# EasyEDA Pro project ADC前置_加减法_AD835_单运放放大.eprj

# Schematic Schematic1
Board Name: Board1; Create Date: 2025-03-10; Page Name: P1; Project Name: ADC前置_加减法_AD835_单运放放大; Schematic Name: Schematic1; Update Date: 2025-06-29; Company: 嘉立创EDA; Page Size: A4; Version: V1.0
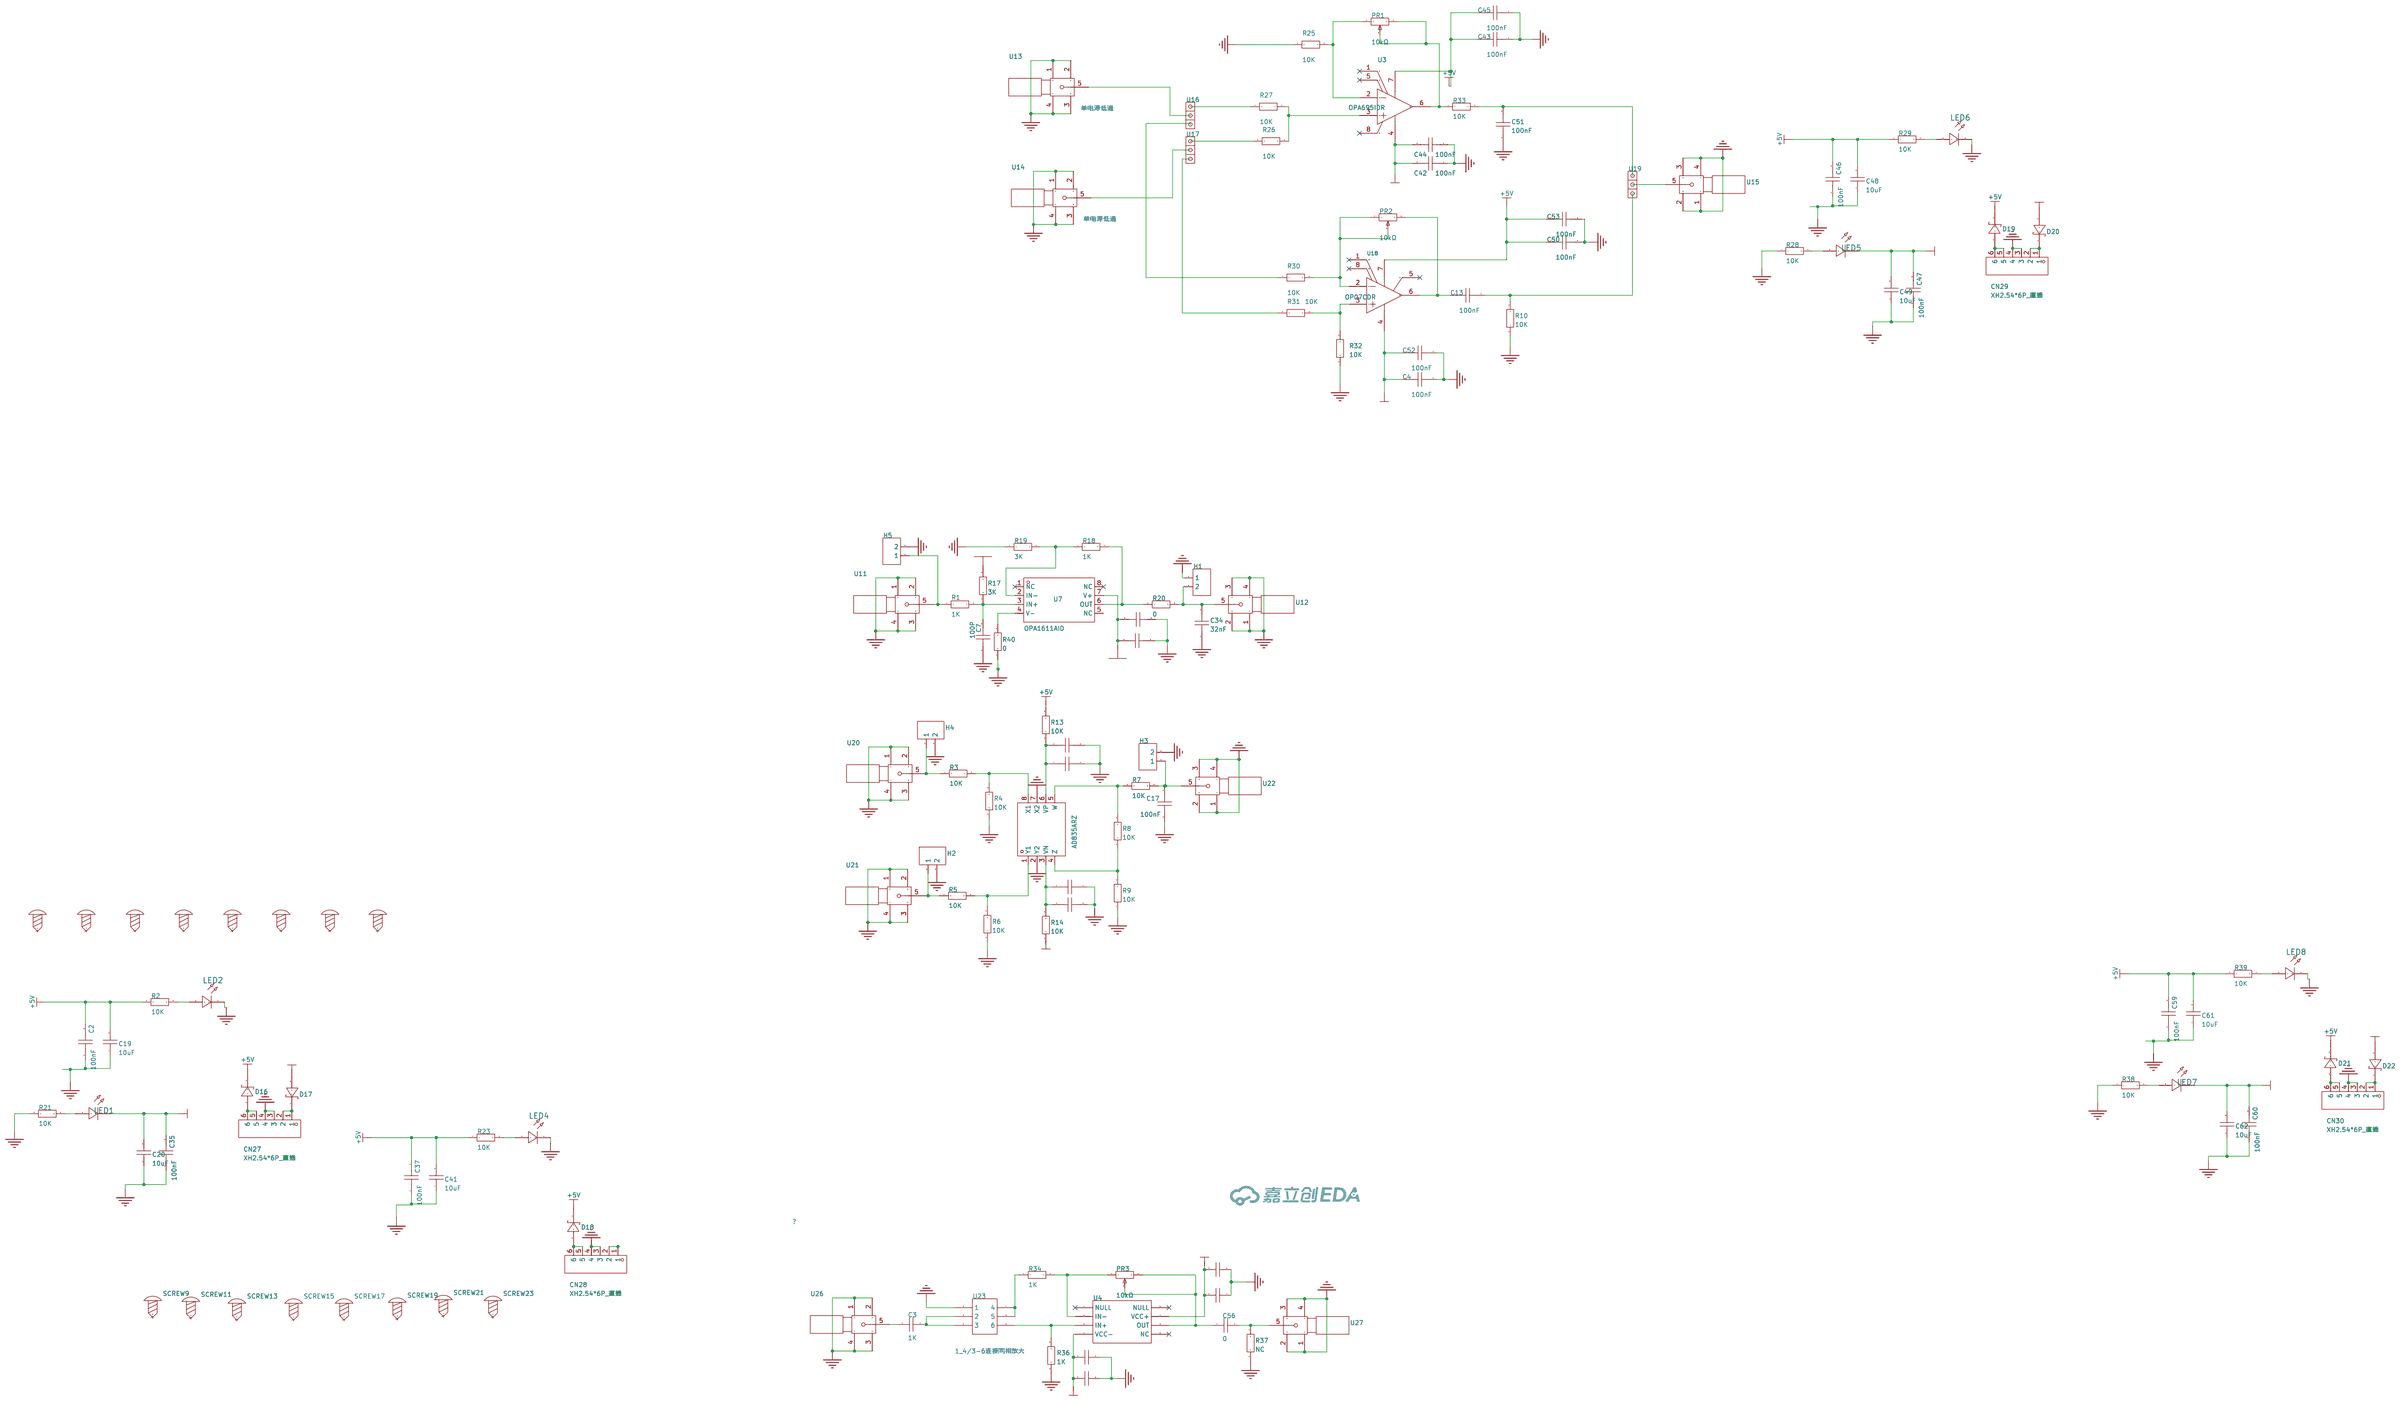
[diagram p0: schematic sheet]

## Parts
C2  100nF  [R0805]
C3  1K  [R0805]
C4  100nF  [R0805]
C5  100nF  [R0805]
C6  100nF  [R0805]
C7  100P  [R0805]
C8  100nF  [R0805]
C9  100nF  [R0805]
C10  100nF  [R0805]
C13  100nF  [R0805]
C17  100nF  [R0805]
C19  10uF  [C1210]
C20  10uF  [C1210]
C34  32nF  [R0805]
C35  100nF  [R0805]
C36  100nF  [R0805]
C37  100nF  [R0805]
C41  10uF  [C1210]
C42  100nF  [R0805]
C43  100nF  [R0805]
C44  100nF  [R0805]
C45  100nF  [R0805]
C46  100nF  [R0805]
C47  100nF  [R0805]
C48  10uF  [C1210]
C49  10uF  [C1210]
C50  100nF  [R0805]
C51  100nF  [R0805]
C52  100nF  [R0805]
C53  100nF  [R0805]
C54  104  [R0805]
C55  104  [R0805]
C56  0  [R0805]
C57  104  [R0805]
C58  104  [R0805]
C59  100nF  [R0805]
C60  100nF  [R0805]
C61  10uF  [C1210]
C62  10uF  [C1210]
CN27  XH2.54*6P_直插  [CONN-TH_XH2.54-6P]
CN28  XH2.54*6P_直插  [CONN-TH_XH2.54-6P]
CN29  XH2.54*6P_直插  [CONN-TH_XH2.54-6P]
CN30  XH2.54*6P_直插  [CONN-TH_XH2.54-6P]
D16  SD103AWS  [SOD-323_L1.8-W1.3-LS2.5-RD]
D17  SD103AWS  [SOD-323_L1.8-W1.3-LS2.5-RD]
D18  SD103AWS  [SOD-323_L1.8-W1.3-LS2.5-RD]
D19  SD103AWS  [SOD-323_L1.8-W1.3-LS2.5-RD]
D20  SD103AWS  [SOD-323_L1.8-W1.3-LS2.5-RD]
D21  SD103AWS  [SOD-323_L1.8-W1.3-LS2.5-RD]
D22  SD103AWS  [SOD-323_L1.8-W1.3-LS2.5-RD]
H1  -  [HDR-TH_2P-P2.54-V-F]
H2  -  [HDR-TH_2P-P2.54-V-F]
H3  -  [HDR-TH_2P-P2.54-V-F]
H4  -  [HDR-TH_2P-P2.54-V-F]
H5  -  [HDR-TH_2P-P2.54-V-F]
LED1  -  [LED_0805]
LED2  -  [LED_0805]
LED4  -  [LED_0805]
LED5  -  [LED_0805]
LED6  -  [LED_0805]
LED7  -  [LED_0805]
LED8  -  [LED_0805]
PR1  10kΩ  [R_3296]
PR2  10kΩ  [R_3296]
PR3  10kΩ  [R_3296]
R1  1K  [R0805]
R2  10K  [R0805]
R3  10K  [R0805]
R4  10K  [R0805]
R5  10K  [R0805]
R6  10K  [R0805]
R7  10K  [R0805]
R8  10K  [R0805]
R9  10K  [R0805]
R10  10K  [R0805]
R13  10K  [R0805]
R14  10K  [R0805]
R17  3K  [R0805]
R18  1K  [R0805]
R19  3K  [R0805]
R20  0  [R0805]
R21  10K  [R0805]
R23  10K  [R0805]
R25  10K  [R0805]
R26  10K  [R0805]
R27  10K  [R0805]
R28  10K  [R0805]
R29  10K  [R0805]
R30  10K  [R0805]
R31  10K  [R0805]
R32  10K  [R0805]
R33  10K  [R0805]
R34  1K  [R0805]
R36  1K  [R0805]
R37  NC  [R0805]
R38  10K  [R0805]
R39  10K  [R0805]
R40  0  [R0805]
SCREW1  -  [M3螺丝]
SCREW2  -  [M3螺丝]
SCREW3  -  [M3螺丝]
SCREW4  -  [M3螺丝]
SCREW5  -  [M3螺丝]
SCREW6  -  [M3螺丝]
SCREW7  -  [M3螺丝]
SCREW8  -  [M3螺丝]
SCREW9  -  [M3螺丝]
SCREW11  -  [M3螺丝]
SCREW13  -  [M3螺丝]
SCREW15  -  [M3螺丝]
SCREW17  -  [M3螺丝]
SCREW19  -  [M3螺丝]
SCREW21  -  [M3螺丝]
SCREW23  -  [M3螺丝]
U1  AD835ARZ  [SOIC-8_L4.9-W3.9-P1.27-LS6.0-TL]
U3  OPA695IDR  [SOIC-8_L5.0-W4.0-P1.27-LS6.1-BL]
U4  -  [THS4001CD]
U7  OPA1611AID  [SOIC-8_L4.9-W3.9-P1.27-LS6.0-BL]
U11  -  [SMA]
U12  -  [SMA]
U13  -  [SMA]
U14  -  [SMA]
U15  -  [SMA]
U16  -  [1*3跳线]
U17  -  [1*3跳线]
U18  OP07CDR  [SOIC-8_L4.9-W3.9-P1.27-LS6.0-BL]
U19  -  [1*3跳线]
U20  -  [SMA]
U21  -  [SMA]
U22  -  [SMA]
U23  -  [3*3连跳线帽]
U26  -  [SMA]
U27  -  [SMA]

## Library data of the parts
C2 C4-C10 C13 C17 C34-C37 C42-C47 C50-C53 C59 C60 = CAP_0805: Supplier Footprint: 0805
C3 C54-C58 = CL21C101JBANNNC: 容值:100pF;精度:±5%;额定电压:50V;材质(温度系数):C0G;; LCSC Part Name: 100pF ±5% 50V; Supplier Part: C1790; Manufacturer: SAMSUNG(三星); Supplier Footprint: 0805; JLCPCB Part Class: 基础库; Datasheet: https://atta.szlcsc.com/upload/public/pdf/source/20160218/1457707763339.pdf; Supplier: LCSC; Tolerance: ±5%; Voltage Rated: 50V; Temperature Coefficient: C0G
C19 C20 C41 C48 C49 C61 C62 = CL32B106KAJNNNE: 容值:10uF;精度:±10%;额定电压:25V;材质(温度系数):X7R;; LCSC Part Name: 10uF ±10% 25V; Supplier Part: C39232; Manufacturer: SAMSUNG(三星); Supplier Footprint: 1210; JLCPCB Part Class: 扩展库; Datasheet: https://atta.szlcsc.com/upload/public/pdf/source/20160218/1457707763339.pdf; Supplier: LCSC; Tolerance: ±10%; Voltage Rated: 25V; Temperature Coefficient: X7R
CN27-CN30 = XH2.54*6P_直插: Supplier Part: C9900008614; Supplier Footprint: XH2.54_6P; JLCPCB Part Class: 扩展库; Supplier: LCSC
D16-D22 = SD103AWS_C181207: 正向压降(Vf):600mV@200mA;直流反向耐压(Vr):40V;整流电流:350mA;; LCSC Part Name: 电压:40V 电流:350mA 丝印S4; Supplier Part: C181207; Manufacturer: Hottech(合科泰); Supplier Footprint: SOD-323; JLCPCB Part Class: 扩展库; Datasheet: https://atta.szlcsc.com/upload/public/pdf/source/20240513/4691873FBB9173EFBCF4C6FD4BBA1025.pdf; Supplier: LCSC; Forward Voltage (Vf@If): 600mV@200mA; Reverse Voltage (Vr): 40V; Rectified Current: 350mA
H1-H5 = HDR-F_2.54_1x2P: Supplier Part: C49661; Supplier Footprint: 插件
LED1 LED2 LED4-LED8 = LED_0805-R: Supplier Footprint: 0805
PR1-PR3 = R_3296: Supplier Footprint: 直插
R1-R10 R13 R14 R17-R21 R23 R25-R33 R38-R40 = Res_0805: Supplier Footprint: 0805
R34 R36 R37 = 0805W8F510JT5E: 电阻类型:厚膜电阻;阻值:51Ω;精度:±1%;功率:125mW;最大工作电压:150V;温度系数:±100ppm/℃;; LCSC Part Name: 51Ω ±1% 125mW 厚膜电阻; Supplier Part: C17738; Manufacturer: UNI-ROYAL(厚声); Supplier Footprint: 0805; JLCPCB Part Class: 基础库; Datasheet: https://atta.szlcsc.com/upload/public/pdf/source/20200306/C422600_1E6D84923E4A46A82E41ADD87F860B5C.pdf; Supplier: LCSC; Type: 厚膜电阻; Tolerance: ±1%; Power(Watts): 125mW; Overload Voltage (Max): 150V; Temperature Coefficient: ±100ppm/℃; Operating Temperature Range: -55℃~+155℃
SCREW1-SCREW9 SCREW11 SCREW13 SCREW15 SCREW17 SCREW19 SCREW21 SCREW23 = M3螺丝: Supplier Footprint: 插件
U1 = AD835ARZ: 象限:四象限;压摆率(SR):1000V/us;带宽:250MHz;; LCSC Part Name: 250 MHz 四象限电压输出乘法器; Supplier Part: C26332; Manufacturer: ADI(亚德诺); Supplier Footprint: SOIC-8; JLCPCB Part Class: 扩展库; Datasheet: https://atta.szlcsc.com/upload/public/pdf/source/20140314/1457707016009.pdf; Supplier: LCSC; Quadrant: 四象限; Slew Rate (SR): 1000V/us; Bandwidth: 250MHz; Supply Voltage: 4.5V~5.5V; Supply Current: 25mA; Operating Temperature: -40℃~+85℃
U3 = OPA695IDR: 放大器数:单路;增益带宽积(GBP):-;输入偏置电流(Ib):20uA;压摆率(SR):4300V/us;带宽(-3db):1.7GHz;; Supplier Part: C1848175; Manufacturer: TI(德州仪器); Supplier Footprint: SOIC-8; JLCPCB Part Class: 扩展库; Datasheet: https://www.ti.com/cn/lit/gpn/opa695; Supplier: LCSC; Number of Circuits: 单路; Current - Input Bias(Ib): 20uA; Slew Rate(SR): 4300V/us; Output Current: 120mA; -3db Bandwidth: 1.7GHz; Operating Temperature: -40℃~+85℃
U4 = THS4001CD
U7 = OPA1611AID: 扬声器通道数:单声道;; Supplier Part: C181405; Manufacturer: TI(德州仪器); Supplier Footprint: SOIC-8; JLCPCB Part Class: 扩展库; Datasheet: https://www.ti.com/cn/lit/gpn/opa1611; Supplier: LCSC; Speaker Channels: 单声道; Operating Temperature: -40℃~+85℃
U11-U15 U20-U22 U26 U27 = SMA
U16 U17 U19 = 1*3跳线
U18 = OP07CDR: 放大器组数:1;增益带宽积(GBP):600kHz;压摆率(SR):0.3V/us;; Supplier Part: C7433; Manufacturer: TI(德州仪器); Supplier Footprint: SOP-8; JLCPCB Part Class: 基础库; Datasheet: http://www.ti.com/cn/lit/gpn/op07c; Supplier: LCSC; Number of Circuits: 1; Gain Bandwidth Product(GBP): 600kHz; Slew Rate(SR): 0.3V/us; Operating Temperature: 0℃~+70℃
U23 = 3*3连跳线帽

## Nets
+5V: C2.2 C5.1 C6.1 C19.2 C37.2 C41.2 C43.2 C45.2 C46.2 C48.2 C50.1 C53.1 C55.2 C58.2 C59.2 C61.2 D16.1(C) D18.1(C) D19.1(C) D21.1(C) R2.1 R13.2 R17.2 R23.1 R29.1 R39.1 U3.7(+VS) U4.7(VCC+) U7.7(V+) U18.7(VCC+)
-5V: C4.1 C20.2 C35.2 C42.2 C44.2 C47.2 C49.2 C52.1 C54.2 C57.2 C60.2 C62.2 D17.2(A) D20.2(A) D22.2(A) LED1.1(C) LED5.1(C) LED7.1(C) R14.1 U3.4(-VS) U4.4(VCC-) U18.4(VCC-)
GND: C2.1 C4.2 C5.2 C6.2 C7.1 C8.2 C9.2 C10.2 C17.1 C19.1 C20.1 C34.1 C35.1 C36.2 C37.1 C41.1 C42.1 C43.1 C44.1 C45.1 C46.1 C47.1 C48.1 C49.1 C50.2 C51.1 C52.2 C53.2 C54.1 C55.1 C57.1 C58.1 C59.1 C60.1 C61.1 C62.1 CN27.3 CN27.4 CN28.3 CN28.4 CN29.3 CN29.4 CN30.3 CN30.4 H1.1 H2.2 H3.2 H4.2 H5.2 LED2.1(C) LED4.1(C) LED6.1(C) LED8.1(C) R4.1 R6.1 R9.1 R10.2 R19.1 R21.1 R25.1 R28.1 R32.1 R36.1 R37.2 R38.1 R40.1 U1.2(Y2) U1.7(X2) U11.1 U11.2 U11.3 U11.4 U12.1 U12.2 U12.3 U12.4 U13.1 U13.2 U13.3 U13.4 U14.1 U14.2 U14.3 U14.4 U15.1 U15.2 U15.3 U15.4 U20.1 U20.2 U20.3 U20.4 U21.1 U21.2 U21.3 U21.4 U22.1 U22.2 U22.3 U22.4 U23.1 U26.1 U26.2 U26.3 U26.4 U27.1 U27.2 U27.3 U27.4
$1N615: R40.2 U7.4(V-)
$1N616: C7.2 R1.2 R17.1 U7.3(IN+)
$1N625: H5.1 R1.1 U11.5
$1N831: R18.1 R19.2 U7.2(IN-)
$1N868: C34.2 H1.2 R20.2 U12.5
$1N887: R18.2 R20.1 U7.6(OUT)
$1N2215: LED1.2(A) R21.2
$1N2216: LED2.2(A) R2.2
$1N2222: H2.1 R5.1 U21.5
$1N2223: R3.2 R4.2 U1.8(X1)
$1N2224: R5.2 R6.2 U1.1(Y1)
$1N2225: R7.1 R8.2 U1.5(W)
$1N2226: C8.1 C36.1 R13.1 U1.6(VP)
$1N2227: C9.1 C10.1 R14.2 U1.3(VN)
$1N2238: H4.1 R3.1 U20.5
$1N2244: R8.1 R9.2 U1.4(Z)
$1N2423: CN27.5 CN27.6 D16.2(A)
$1N2424: CN27.1 CN27.2 D17.1(C)
$1N2910: CN28.1 CN28.2
$1N2912: CN28.5 CN28.6 D18.2(A)
$1N2922: LED4.2(A) R23.2
$1N5837: R26.2 R27.2 U3.3(+IN)
$1N6828: LED6.2(A) R29.2
$1N6831: CN29.1 CN29.2 D20.1(C)
$1N6833: LED5.2(A) R28.2
$1N6836: CN29.5 CN29.6 D19.2(A)
$1N6851: U13.5 U16.2
$1N6855: R26.1 U17.1
$1N6938: R27.1 U16.1
$1N6961: U14.5 U17.2
$1N7310: PR2.1 PR2.2 R30.2 U18.2(IN-)
$1N7312: R31.2 R32.2 U18.3(IN+)
$1N7316: C13.2 R10.1 U19.3
$1N7320: R30.1 U16.3
$1N7321: R31.1 U17.3
$1N7401: C51.2 R33.2 U19.1
$1N7406: PR1.2 PR1.3 R33.1 U3.6(Output)
$1N7721: U15.5 U19.2
$1N7904: C17.2 H3.1 R7.2 U22.5
$1N8307: PR1.1 R25.2 U3.2(-IN)
$1N10205: C13.1 PR2.3 U18.6(OUT)
$1N10928: C3.2 U23.2 U23.3
$1N10939: C56.2 R37.1 U27.5
$1N10941: C3.1 U26.5
$1N10942: R34.1 U23.4 U23.5
$1N10943: R36.2 U4.3(IN+) U23.6
$1N11055: C56.1 PR3.2 PR3.3 U4.6(OUT)
$1N11124: PR3.1 R34.2 U4.2(IN-)
$1N11684: LED7.2(A) R38.2
$1N11686: CN30.5 CN30.6 D21.2(A)
$1N11690: LED8.2(A) R39.2
$1N11693: CN30.1 CN30.2 D22.1(C)

Not connected (* = marked no-connect by the designer): SCREW1 1; SCREW2 1; SCREW3 1; SCREW4 1; SCREW5 1; SCREW6 1; SCREW7 1; SCREW8 1; SCREW9 1; SCREW11 1; SCREW13 1; SCREW15 1; SCREW17 1; SCREW19 1; SCREW21 1; SCREW23 1; U3 1(NC)* 5(NC)* 8(DIS#)*; U4 1(NULL)* 5(NC)* 8(NULL)*; U7 1(NC)* 5(NC) 8(NC)*; U18 1(OFFSET N1)* 5(NC)* 8(OFFSET N2)*

## Notes on the sheet
- 单电源低通
- 单电源低通
- 1_4/3-6连接同相放大

# Board PCB1
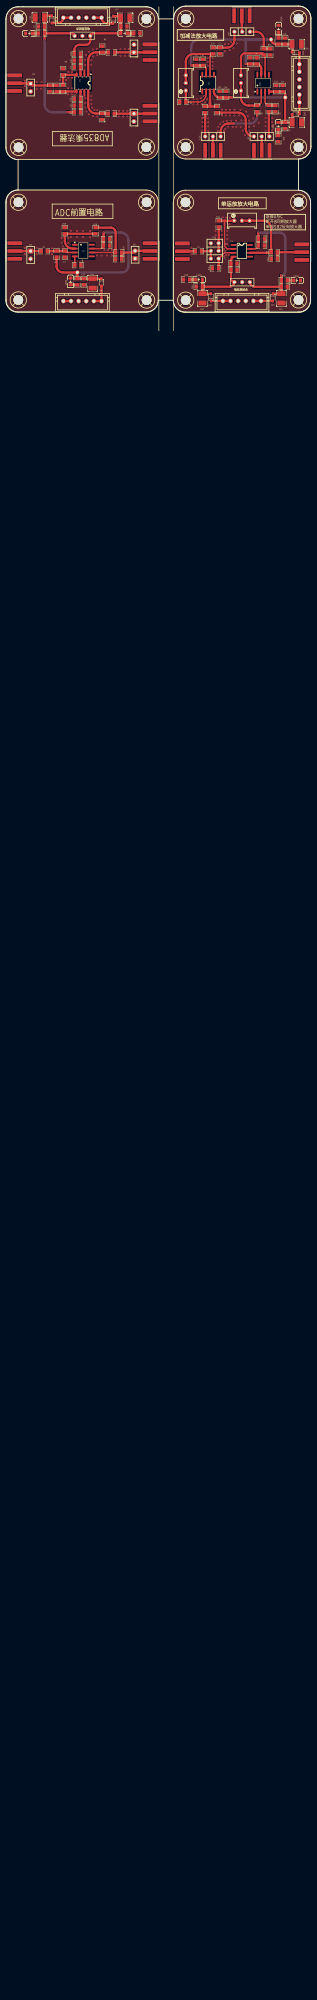
[diagram p1: board, top side]
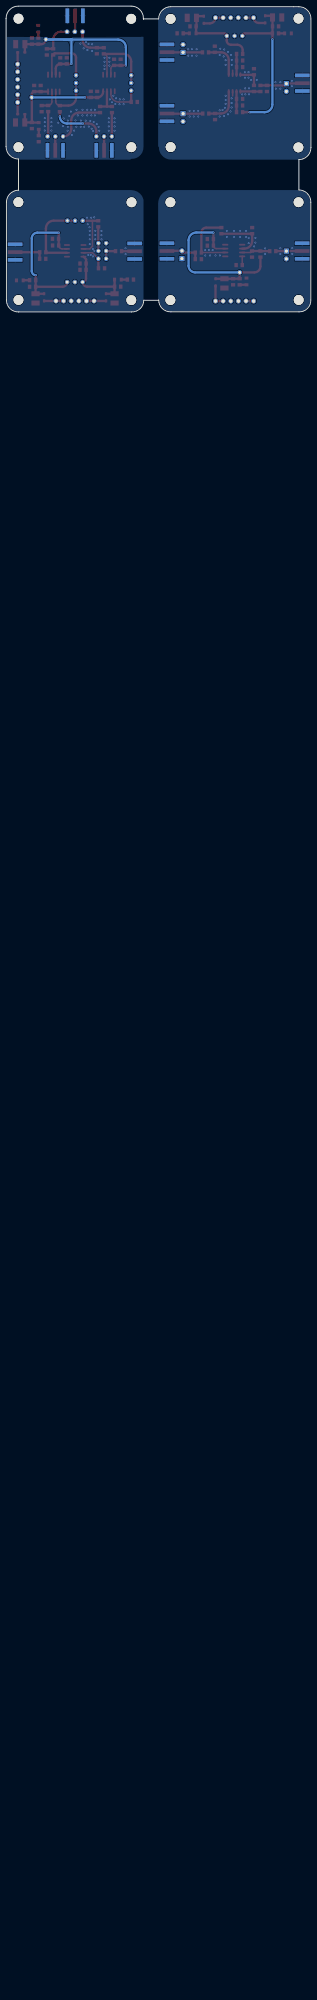
[diagram p2: board, bottom side, seen from below]

Outline 99.9 x 100.01 mm; copper layers: Top Layer, Bottom Layer. Coordinates in mm from the lower left corner of the outline.
Outline path: 54.9,95.81 49.9,95.81 arc(48.73,98.64) 45.9,99.81 3.9,99.81 arc(1.11,98.63) 0,95.81 0,53.81 arc(1.11,51) 3.9,49.81 arc(3.92,49.8) 3.93,49.78 3.93,39.88 arc(1.13,38.68) 0.04,35.84 0.04,3.87 arc(1.13,1.12) 3.89,0.02 45.89,0.02 arc(48.7,1.1) 49.89,3.87 arc(49.91,3.82) 49.96,3.8 54.79,3.8 arc(55.99,1.05) 58.79,0 95.79,0 arc(98.6,1.05) 99.79,3.8 99.79,35.8 arc(98.62,38.63) 95.79,39.8 arc(95.83,39.82) 95.85,39.86 95.85,50.01 arc(98.71,51.2) 99.9,54.06 99.9,96.01 arc(98.73,98.84) 95.9,100.01 58.9,100.01 arc(56.07,98.84) 54.9,96.01 54.9,95.81 ; 54.9,95.81 54.9,95.81 ; 54.9,95.81 arc(54.9,95.81) 54.9,95.81 ; 54.9,95.81 54.9,95.81
Stack: Top Layer 0.035mm / Dielectric1 1.51mm FR4 er 4.5 / Bottom Layer 0.035mm

## Design rules (mm)
template: 自定义配置
spacing copperThickness1oz (default): track to track 0.152, other pairs 0.152 to 0.3
spacing copperThickness2oz: track to track 0.203, other pairs 0.152 to 0.3
track width copperThickness1oz (default): min 0.127, default 0.254, max 2.54
track width copperThickness2oz: min 0.203, default 0.254, max 2.54
differential pair differentialPair (default): width min 0.127, default 0.254, max 2.54; gap min 0.152, default 0.152
via viaSize (default): diameter min 0.5, default 0.61, max 10; hole min 0.3, default 0.305, max 6.299

## Placement (name value [footprint] x y rotation side)
C2  100nF  [R0805#2]  11.69 93.38 0 top
C3  1K  [R0805#2]  63.15 19.86 0 top
C4  100nF  [R0805#2]  90.7 73.16 90 top
C5  100nF  [R0805#2]  33.05 23.83 0 top
C6  100nF  [R0805#2]  33.05 21.67 0 top
C7  100P  [R0805#2]  19.3 19.02 90 top
C8  100nF  [R0805#2]  23.27 67.5 180 top
C9  100nF  [R0805#2]  23.25 80.06 180 top
C10  100nF  [R0805#2]  23.25 82.22 180 top
C13  100nF  [R0805#2]  84.45 85.16 90 top
C17  100nF  [R0805#2]  14.43 73.18 90 top
C19  10uF  [C1210]  11.06 96.3 0 top
C20  10uF  [C1210]  39.02 96.17 180 top
C34  32nF  [R0805#2]  37 17.24 0 top
C35  100nF  [R0805#2]  38.52 93.38 180 top
C36  100nF  [R0805#2]  23.27 69.67 180 top
C37  100nF  [R0805#2]  25.5 9.96 90 top
C41  10uF  [C1210]  28.35 9.31 90 top
C42  100nF  [R0805#2]  70.06 71.01 270 top
C43  100nF  [R0805#2]  62.36 81.51 270 top
C44  100nF  [R0805#2]  72.13 71.03 270 top
C45  100nF  [R0805#2]  64.51 81.5 270 top
C46  100nF  [R0805#2]  91.45 88.46 270 top
C47  100nF  [R0805#2]  91.46 61.07 90 top
C48  10uF  [C1210]  95.25 87.56 180 top
C49  10uF  [C1210]  95.3 61.96 180 top
C50  100nF  [R0805#2]  82.16 82.21 90 top
C51  100nF  [R0805#2]  70.16 85.53 90 top
C52  100nF  [R0805#2]  88.57 73.16 90 top
C53  100nF  [R0805#2]  80 82.21 90 top
C54  104  [R0805#2]  74.57 15.82 180 top
C55  104  [R0805#2]  83.6 23.91 180 top
C56  0  [R0805#2]  87.99 19.51 0 top
C57  104  [R0805#2]  74.58 13.76 180 top
C58  104  [R0805#2]  83.55 21.72 180 top
C59  100nF  [R0805#2]  91.1 8.21 180 top
C60  100nF  [R0805#2]  63.45 8.26 0 top
C61  10uF  [C1210]  90.25 4.41 90 top
C62  10uF  [C1210]  64.35 4.41 90 top
CN27  XH2.54*6P_直插  [CONN-TH_XH2.54-6P]  25.04 96.22 180 top
CN28  XH2.54*6P_直插  [CONN-TH_XH2.54-6P]  25.02 3.54 0 top
CN29  XH2.54*6P_直插  [CONN-TH_XH2.54-6P]  96.13 74.78 90 top
CN30  XH2.54*6P_直插  [CONN-TH_XH2.54-6P]  77.32 3.58 0 top
D16  SD103AWS  [SOD-323_L1.8-W1.3-LS2.5-RD]  14.98 95.68 270 top
D17  SD103AWS  [SOD-323_L1.8-W1.3-LS2.5-RD]  35.1 95.55 90 top
D18  SD103AWS  [SOD-323_L1.8-W1.3-LS2.5-RD]  31.25 9.66 270 top
D19  SD103AWS  [SOD-323_L1.8-W1.3-LS2.5-RD]  94.93 84.88 0 top
D20  SD103AWS  [SOD-323_L1.8-W1.3-LS2.5-RD]  94.93 64.68 180 top
D21  SD103AWS  [SOD-323_L1.8-W1.3-LS2.5-RD]  87.45 4.76 270 top
D22  SD103AWS  [SOD-323_L1.8-W1.3-LS2.5-RD]  67.15 4.76 90 top
H1  -  [HDR-TH_2P-P2.54-V-F]  42.28 18.7 90 top
H2  -  [HDR-TH_2P-P2.54-V-F]  41.91 86.15 90 top
H3  -  [HDR-TH_2P-P2.54-V-F]  8.05 73.38 270 top
H4  -  [HDR-TH_2P-P2.54-V-F]  41.91 63.55 270 top
H5  -  [HDR-TH_2P-P2.54-V-F]  8.05 18.61 270 top
LED1  -  [LED_0805]  38.78 91.11 0 top
LED2  -  [LED_0805]  7.56 91.09 0 top
LED4  -  [LED_0805]  21.1 9.91 270 top
LED5  -  [LED_0805]  89.19 60.76 270 top
LED6  -  [LED_0805]  89.33 92.58 270 top
LED7  -  [LED_0805]  63.2 10.56 180 top
LED8  -  [LED_0805]  95.35 10.31 180 top
NOREF  -  [Pad_e586]  86.85 89.11 0 top
NOREF#2  -  [Pad_e249]  23.35 12.91 0 top
NOREF#3  -  [Pad_e705]  91.5 70.14 0 top
NOREF#4  -  [Pad_e1287]  79.9 9.75 180 top
NOREF#5  -  [Pad_e608]  25.02 90.26 0 top
NOREF#6  -  [Pad_e1288]  77.36 9.75 180 top
NOREF#7  -  [Pad_e610]  27.56 90.26 0 top
NOREF#8  -  [Pad_e609]  22.48 90.26 0 top
NOREF#9  -  [Pad_e1289]  74.82 9.75 180 top
PR1  10kΩ  [R_3296]  58.78 74.88 90 top
PR2  10kΩ  [R_3296]  76.85 74.86 90 top
PR3  10kΩ  [R_3296]  77.3 29.96 0 top
R1  1K  [R0805]  12.5 19.86 0 top
R2  10K  [R0805]  11.61 91.09 180 top
R3  10K  [R0805]  34.45 64.87 180 top
R4  10K  [R0805]  31.42 63.89 90 top
R5  10K  [R0805]  34.54 84.88 180 top
R6  10K  [R0805]  31.49 85.9 270 top
R7  10K  [R0805]  16.55 73.07 90 top
R8  10K  [R0805]  18.67 73.07 270 top
R9  10K  [R0805]  18.67 78.53 270 top
R10  10K  [R0805]  86.56 85.03 270 top
R13  10K  [R0805]  23.38 65.33 180 top
R14  10K  [R0805]  23.37 84.38 0 top
R17  3K  [R0805]  16.55 18.91 270 top
R18  1K  [R0805]  29.35 26.56 90 top
R19  3K  [R0805]  19.25 26.56 270 top
R20  0  [R0805]  36.89 19.41 0 top
R21  10K  [R0805]  42.85 91.11 180 top
R23  10K  [R0805]  23.35 9.86 270 top
R25  10K  [R0805]  57.9 68.66 0 top
R26  10K  [R0805]  69.11 66.18 90 top
R27  10K  [R0805]  65.2 66.18 90 top
R28  10K  [R0805]  89.2 56.66 90 top
R29  10K  [R0805]  89.33 88.58 90 top
R30  10K  [R0805]  82.28 66.48 90 top
R31  10K  [R0805]  86.1 66.51 90 top
R32  10K  [R0805]  88.25 66.48 90 top
R33  10K  [R0805]  67.87 85.39 90 top
R34  1K  [R0805]  69.7 28.81 90 top
R36  1K  [R0805]  68.63 14.27 0 top
R37  NC  [R0805]  87.9 17.36 180 top
R38  10K  [R0805]  59.15 10.56 0 top
R39  10K  [R0805]  91.2 10.36 0 top
R40  0  [R0805]  23.5 15.31 180 top
SCREW1  -  [M3螺丝]  45.98 95.84 180 top
SCREW2  -  [M3螺丝]  4.06 95.93 180 top
SCREW3  -  [M3螺丝]  45.97 53.9 180 top
SCREW4  -  [M3螺丝]  4.09 53.8 180 top
SCREW5  -  [M3螺丝]  4 3.91 0 top
SCREW6  -  [M3螺丝]  4.04 35.87 0 top
SCREW7  -  [M3螺丝]  46.05 35.86 0 top
SCREW8  -  [M3螺丝]  46.05 3.86 0 top
SCREW9  -  [M3螺丝]  58.9 95.86 0 top
SCREW11  -  [M3螺丝]  58.79 35.85 0 top
SCREW13  -  [M3螺丝]  95.88 35.89 0 top
SCREW15  -  [M3螺丝]  58.87 3.84 0 top
SCREW17  -  [M3螺丝]  95.85 3.91 0 top
SCREW19  -  [M3螺丝]  58.85 53.86 0 top
SCREW21  -  [M3螺丝]  95.85 53.86 0 top
SCREW23  -  [M3螺丝]  95.84 95.91 0 top
U1  AD835ARZ  [SOIC-8_L4.9-W3.9-P1.27-LS6.0-TL]  25.02 74.85 270 top
U3  OPA695IDR  [SOIC-8_L5.0-W4.0-P1.27-LS6.1-BL]  66.2 74.86 0 top
U4  -  [THS4001CD]  77.35 19.36 0 top
U7  OPA1611AID  [SOIC-8_L4.9-W3.9-P1.27-LS6.0-BL]  25.3 20.06 270 top
U11  -  [SMA]  -0.94 14.05 0 top
U12  -  [SMA]  51 25.76 180 top
U13  -  [SMA]  73.65 49.01 90 top
U14  -  [SMA]  89.65 49.01 90 top
U15  -  [SMA]  71.42 100.66 270 top
U16  -  [1*3跳线]  70.33 57.38 90 top
U17  -  [1*3跳线]  86.31 57.38 90 top
U18  OP07CDR  [SOIC-8_L4.9-W3.9-P1.27-LS6.0-BL]  84.25 74.81 0 top
U19  -  [1*3跳线]  79.92 91.62 90 top
U20  -  [SMA]  50.99 70.74 180 top
U21  -  [SMA]  50.98 90.8 180 top
U22  -  [SMA]  -1 68.94 0 top
U23  -  [3*3连跳线帽]  72.2 27.56 0 top
U26  -  [SMA]  53.97 13.98 0 top
U27  -  [SMA]  100.75 25.41 180 top

## Footprints (pads in the part's own frame, mm; a bottom-side part is the same pattern mirrored in y, then rotated)
1*3跳线
  round 1.524 hole 0.914: 1(0,5.08) 2(0,2.54) 3(0,0)
3*3连跳线帽
  round 1.524 hole 0.914: 1(-5.08,-5.08) 2(-5.08,-7.62) 3(-5.08,-10.16) 4(-2.54,-5.08) 5(-2.54,-7.62) 6(-2.54,-10.16)
C1210
  rect 1.635x2.7 smd: 1(-1.518,0) 2(1.518,0)
CONN-TH_XH2.54-6P
  round 1.65 hole 1.1: 1(-6.25,0) 2(-3.75,0) 3(-1.25,0) 4(1.25,0) 5(3.75,0) 6(6.25,0)
HDR-TH_2P-P2.54-V-F
  rect 1.7x1.7 hole 1: 1(-1.27,0)
  round 1.7 hole 1: 2(1.27,0)
LED_0805
  rect 1x1.25 smd: 1(-1.15,0.005) 2(1.05,0.005)
M3螺丝
  round 3.2 hole 3.2: 1(0,0)
Pad_e249
  round 1.524 hole 0.914: 1(0,0)
Pad_e586
  round 1.524 hole 0.914: 1(0,0)
Pad_e608
  round 1.524 hole 0.914: 1(0,0)
Pad_e609
  round 1.524 hole 0.914: 2(0,0)
Pad_e610
  round 1.524 hole 0.914: 3(0,0)
Pad_e705
  round 1.524 hole 0.914: 1(0,0)
Pad_e1287
  round 1.524 hole 0.914: 2(0,0)
Pad_e1288
  round 1.524 hole 0.914: 1(0,0)
Pad_e1289
  round 1.524 hole 0.914: 3(0,0)
R0805
  rect 1.133x1.377 smd: 1(-1,0) 2(1,0)
R0805#2
  rect 1.133x1.377 smd: 1(-1.111,0) 2(0.889,0)
R_3296
  round 1.524 hole 0.762: 1(-2.499,-0.127) 2(0,-0.127) 3(2.499,-0.127)
SMA
  rect 4.8x1.2 smd: 1(3.81,8.412) 2(3.81,3.312) 5(3.81,5.862)
  rect 4.8x1.2 smd far side: 3(3.81,3.312) 4(3.81,8.412)
SOD-323_L1.8-W1.3-LS2.5-RD
  rect 1x0.75 smd: 1(-1.173,0) 2(1.173,0)
SOIC-8_L4.9-W3.9-P1.27-LS6.0-BL
  oval 0.588x2.045 smd: 1(-1.905,-2.772) 2(-0.635,-2.772) 3(0.635,-2.772) 4(1.905,-2.772) 5(1.905,2.772) 6(0.635,2.772) 7(-0.635,2.772) 8(-1.905,2.772)
SOIC-8_L4.9-W3.9-P1.27-LS6.0-TL
  oval 1.52x0.6 smd: 1(-2.74,1.905) 2(-2.74,0.635) 3(-2.74,-0.635) 4(-2.74,-1.905) 5(2.74,-1.905) 6(2.74,-0.635) 7(2.74,0.635) 8(2.74,1.905)
SOIC-8_L5.0-W4.0-P1.27-LS6.1-BL
  oval 0.569x1.95 smd: 1(-1.905,-2.705) 2(-0.635,-2.705) 3(0.635,-2.705) 4(1.905,-2.705) 5(1.905,2.705) 6(0.635,2.705) 7(-0.635,2.705) 8(-1.905,2.705)
THS4001CD
  oval 1.95x0.569 smd: 1(-2.804,2.51) 2(-2.804,1.24) 3(-2.804,-0.029) 4(-2.804,-1.3) 5(2.606,-1.3) 6(2.606,-0.029) 7(2.606,1.24) 8(2.606,2.51)

## Nets
As in the schematic, except:
+5V: C2.2 C5.1 C6.1 C19.2 C37.2 C41.2 C43.2 C45.2 C46.2 C48.2 C50.1 C53.1 C55.2 C58.2 C59.2 C61.2 D16.1 D18.1 D19.1 D21.1 NOREF.1 NOREF#2.1 NOREF#4.2 NOREF#8.2 R2.1 R13.2 R17.2 R23.1 R29.1 R39.1 U3.7 U4.7 U7.7 U18.7
-5V: C4.1 C20.2 C35.2 C42.2 C44.2 C47.2 C49.2 C52.1 C54.2 C57.2 C60.2 C62.2 D17.2 D20.2 D22.2 LED1.1 LED5.1 LED7.1 NOREF#3.1 NOREF#7.3 NOREF#9.3 R14.1 U3.4 U4.4 U18.4
GND: C2.1 C4.2 C5.2 C6.2 C7.1 C8.2 C9.2 C10.2 C17.1 C19.1 C20.1 C34.1 C35.1 C36.2 C37.1 C41.1 C42.1 C43.1 C44.1 C45.1 C46.1 C47.1 C48.1 C49.1 C50.2 C51.1 C52.2 C53.2 C54.1 C55.1 C57.1 C58.1 C59.1 C60.1 C61.1 C62.1 CN27.3 CN27.4 CN28.3 CN28.4 CN29.3 CN29.4 CN30.3 CN30.4 H1.1 H2.2 H3.2 H4.2 H5.2 LED2.1 LED4.1 LED6.1 LED8.1 NOREF#5.1 NOREF#6.1 R4.1 R6.1 R9.1 R10.2 R19.1 R21.1 R25.1 R28.1 R32.1 R36.1 R37.2 R38.1 R40.1 U1.2 U1.7 U11.1 U11.2 U11.3 U11.4 U12.1 U12.2 U12.3 U12.4 U13.1 U13.2 U13.3 U13.4 U14.1 U14.2 U14.3 U14.4 U15.1 U15.2 U15.3 U15.4 U20.1 U20.2 U20.3 U20.4 U21.1 U21.2 U21.3 U21.4 U22.1 U22.2 U22.3 U22.4 U23.1 U26.1 U26.2 U26.3 U26.4 U27.1 U27.2 U27.3 U27.4

Pads without a net: SCREW1 1; SCREW2 1; SCREW3 1; SCREW4 1; SCREW5 1; SCREW6 1; SCREW7 1; SCREW8 1; SCREW9 1; SCREW11 1; SCREW13 1; SCREW15 1; SCREW17 1; SCREW19 1; SCREW21 1; SCREW23 1; U3 1 5 8; U4 1 5 8; U7 1 5 8; U18 1 5 8

## Via types
v1: diameter 0.61, hole 0.305, Top Layer to Bottom Layer, 183 vias

## Routing (per net, layer and track width the routed paths; a pad name or vN(x,y) marks a point on that pad's centre or on a via; arc(x,y) is an arc through that point)
+5V: length 2226.9
  Top Layer w0.508: U4.7 81.54,20.6 arc(82.33,20.93) C58.2 ; 28.07,20.7 30.97,20.7 arc(31.66,20.98) 31.94,21.67 ; U3.7 65.56,79.56 arc(65.26,80.31) C45.2
  Top Layer w0.762: v1(31.95,25.96) 31.95,23.84 arc(31.95,23.83) 31.94,23.83 31.94,21.67 ; 14.98,96.85 13.13,96.85 arc(12.74,96.69) C19.2 arc(12.58,96.3) 12.58,96.29 C2.2 12.58,91.12 arc(12.59,91.1) R2.1 ; C59.2 90.21,10.35 arc(90.21,10.36) R39.1 v1(90.2,12.01) ; C59.2 81.44,8.21 arc(80.35,8.66) NOREF#4.2 ; C59.2 arc(90.24,8.2) 90.25,8.17 C61.2 arc(90.25,5.93) 90.24,5.94 D21.1 ; D18.1 28.35,10.84 arc(28.35,10.83) C41.2 25.52,10.83 arc(25.51,10.84) C37.2 arc(25.5,10.86) 25.49,10.86 R23.1 NOREF#2.1 18.55,12.91 arc(17.14,13.5) 16.55,14.91 R17.2 ; U18.7 83.62,79.64 arc(83.19,80.67) C50.1 80.01,81.09 arc(80.01,81.1) C53.1 v1(78.5,81.1) ; C45.2 62.36,80.62 arc(62.36,80.62) C43.2 v1(60.65,80.62) ; v1(82.65,25.91) 82.65,23.97 arc(82.67,23.92) C55.2 arc(82.67,23.89) 82.66,23.86 C58.2 ; v1(20.1,65.31) 22.36,65.31 arc(22.37,65.32) R13.2 ; R2.1 v1(12.61,89.11) ; R2.1 21.64,91.09 arc(22.23,90.85) NOREF#8.2 ; 93.76,84.88 93.76,87.54 arc(93.75,87.56) C48.2 arc(93.73,87.57) 93.72,87.57 C46.2 arc(91.45,87.58) 91.44,87.58 R29.1 88.28,87.58 arc(87.38,87.96) 87,88.86
  Bottom Layer w0.762: 78.23,89.06 63.19,89.06 arc(61.39,88.32) 60.65,86.52 v1(60.65,80.62) ; 78.23,89.06 78.5,89.06 ; 78.23,89.06 arc(78.39,89.06) 78.55,89.06 arc(73.78,-550.14) 86.81,89.06 ; 78.5,89.06 86.8,89.06 arc(86.81,89.06) 86.81,89.06 ; 78.5,89.06 v1(78.5,81.1) ; v1(31.95,25.96) 37.56,25.96 arc(39.36,25.22) 40.1,23.42 40.1,15.06 arc(39.47,13.54) 37.95,12.91 NOREF#2.1 ; v1(20.1,65.31) 15.15,65.31 arc(13.36,66.06) 12.61,67.85 v1(12.61,89.11) ; v1(82.65,25.91) 89.65,25.91 arc(90.96,25.37) 91.5,24.06 91.5,13.31 arc(91.12,12.39) v1(90.2,12.01) ; 86.81,89.06 arc(86.83,89.06) 86.85,89.06 arc(86.83,89.06) 86.81,89.06 ; 86.81,89.06 arc(86.84,89.08) NOREF.1
-5V: length 103.3
  Top Layer w0.762: C47.2 91.46,71.3 arc(91.24,71.83) C4.1 88.57,72.05 arc(88.57,72.05) C52.1 86.17,72.05 arc(86.16,72.05) U18.4 ; C47.2 C49.2 arc(93.76,61.97) 93.76,61.99 93.76,64.68 ; C47.2 arc(91.45,61.93) 91.41,61.91 LED5.1 ; C60.2 64.34,10.55 arc(64.34,10.55) LED7.1 ; C60.2 73.34,8.26 arc(74.39,8.7) NOREF#9.3 arc(74.03,10.08) 73.7,10.87 73.7,13.75 arc(73.7,13.76) C57.2 73.69,15.81 C54.2 73.68,17.2 U4.4 ; C60.2 arc(64.35,8.26) 64.35,8.25 C62.2 arc(64.35,5.93) 64.35,5.94 D22.2 ; v1(74.05,70.14) C44.2 70.08,70.14 arc(70.06,70.13) C42.2 arc(68.68,70.69) 68.1,72.07 68.1,72.16 ; R14.1 22.37,85.63 arc(22.87,86.86) 24.1,87.36 26.2,87.36 arc(27.19,87.77) 27.6,88.76 27.6,90.22 arc(27.59,90.25) NOREF#7.3 arc(27.81,90.86) 28.41,91.11 37.63,91.11 37.63,93.37 arc(37.63,93.38) C35.2 arc(37.54,93.42) 37.51,93.5 C20.2 arc(37.35,96.56) 36.96,96.73 D17.2
  Bottom Layer w0.762: v1(74.05,70.14) NOREF#3.1
GND: length 2.9
  Top Layer w0.508: U1.7 25.65,70.66 ; U1.2 25.65,79.01
  vias: v1(6.1,20.85) v1(6.1,18.96) v1(6.2,75.59) v1(6.2,73.81) v1(10,75.11) v1(10,73.01) v1(10,20.81) v1(10,18.94) v1(11.5,73.01) v1(11.63,75.11) v1(15,20.76) v1(15,18.91) v1(17.75,75.86) v1(18.2,24.21) v1(18.2,22.66) v1(18.6,21.41) v1(19.6,75.86) v1(20.3,73.11) v1(20.3,71.16) v1(20.4,24.21) v1(20.4,22.48) v1(20.45,78.41) v1(20.45,76.61) v1(21.25,26.51) v1(21.24,24.51) v1(21.49,71.16) v1(21.53,73.11) v1(21.65,78.41) v1(21.61,76.61) v1(22.54,71.11) v1(23.19,26.51) v1(23.18,24.51) v1(25.2,26.51) v1(25.19,24.51) v1(25.95,82.41) v1(25.95,80.77) v1(26,69.86) v1(26,68.33) v1(26,66.86) v1(26.2,84.06) v1(26.35,65.56) v1(27.15,85.06) v1(27.15,64.61) v1(27.56,26.51) v1(27.56,24.51) v1(27.95,82.32) v1(27.95,80.81) v1(27.95,70.7) v1(27.95,69.31) v1(27.95,68.06) v1(28.2,66.76) v1(28.4,85.81) v1(28.45,64.06) v1(28.6,83.56) v1(28.97,66.06) v1(29.7,86.06) v1(29.85,18.46) v1(29.9,84.01) v1(29.9,65.91) v1(29.9,63.91) v1(31.27,18.46) v1(32.2,20.21) v1(33.05,18.46) v1(33.44,20.21) v1(34.63,20.21) v1(34.62,18.46) v1(36.94,65.76) v1(36.91,63.91) v1(37.45,85.91) v1(37.5,83.81) v1(38.38,65.76) v1(38.41,63.91) v1(38.99,85.91) v1(38.95,83.81) v1(39.75,65.76) v1(39.75,63.91) v1(40.2,85.91) v1(40.2,83.81) v1(60.75,20.8) v1(60.75,18.86) v1(61.4,69.5) v1(61.4,67.91) v1(62.66,69.5) v1(62.75,67.91) v1(63.85,69.86) v1(64.1,68.01) v1(64.35,63.32) v1(64.35,62.01) v1(64.35,60.66) v1(64.35,59.26) v1(64.75,70.71) v1(65.2,68.56) v1(65.9,69.51) v1(66.05,83.11) v1(66.05,81.82) v1(66.05,80.56) v1(66.25,63.31) v1(66.25,62.01) v1(66.25,60.65) v1(66.25,59.26) v1(67.65,83.11) v1(67.65,81.81) v1(67.65,80.55) v1(67.65,79.46) v1(68.65,26.46) v1(68.65,25.08) v1(68.65,23.73) v1(69.35,59.26) v1(69.6,60.51) v1(70.2,61.41) v1(70.65,26.51) v1(70.65,25.15) v1(70.67,23.75) v1(70.8,66.11) v1(70.8,64.26) v1(70.93,19.94) v1(71,30.91) v1(71.2,62.11) v1(71.4,59.16) v1(71.45,20.56) v1(71.45,18.16) v1(71.7,87.51) v1(71.7,85.31) v1(71.85,59.91) v1(71.99,66.11) v1(71.96,64.26) v1(72,30.81) v1(72.15,18.61) v1(72.3,62.46) v1(72.55,27.67) v1(72.5,26.51) v1(72.5,25.14) v1(72.5,23.76) v1(72.5,22.16) v1(72.8,60.61) v1(72.9,87.61) v1(72.95,18.61) v1(73.15,28.66) v1(73.25,85.66) v1(73.3,66.11) v1(73.29,64.26) v1(73.36,30.81) v1(73.7,88.21) v1(73.8,62.56) v1(74.3,60.56) v1(74.5,86.21) v1(74.86,66.11) v1(74.87,64.26) v1(75.38,62.56) v1(75.45,60.56) v1(75.55,87.76) v1(76.42,64.26) v1(76.81,66.11) v1(76.88,60.56) v1(77.15,62.61) v1(77.6,59.31) v1(78.35,57.86) v1(78.65,65.51) v1(79.2,64.06) v1(79.65,62.56) v1(79.65,60.51) v1(79.75,59.26) v1(81.05,63.26) v1(81.25,60.76) v1(82.8,61.86) v1(85.05,63.36) v1(85.05,62.06) v1(85.05,60.7) v1(85.05,59.31) v1(87.25,63.36) v1(87.25,62.06) v1(87.25,60.7) v1(87.25,59.31)
$1N615: length 2.9
  Top Layer w0.508: R40.2 22.5,18.13 arc(22.51,18.15) U7.4
$1N616: length 9.3
  Top Layer w0.508: U7.3 19.78,19.43 arc(19.44,19.57) C7.2
  Top Layer w0.762: R1.2 16.5,19.86 arc(16.54,19.88) R17.1 C7.2
$1N625: length 8.7
  Top Layer w0.762: U11.5 8.03,19.91 arc(8.04,19.9) H5.1 11.48,19.88 arc(11.49,19.88) R1.1
$1N831: length 17.2
  Top Layer w0.762: R18.1 R19.2 19.25,23.24 arc(19.99,21.44) 21.79,20.7 22.53,20.7
$1N868: length 11.8
  Top Layer w0.762: C34.2 R20.2 41.72,19.41 arc(42.11,19.57) H1.2 47.13,19.97 arc(47.17,19.95) U12.5
$1N887: length 21.9
  Top Layer w0.508: U7.6 35.87,19.43 arc(35.89,19.42) R20.1
  Top Layer w0.762: R18.2 34.3,27.56 arc(35.43,27.1) 35.89,25.97 R20.1
$1N2215: length 2
  Top Layer w0.762: LED1.2 41.84,91.11 arc(41.85,91.11) R21.2
$1N2216: length 2
  Top Layer w0.762: 8.61,91.09 10.61,91.09 arc(10.61,91.09) R2.2
$1N2222: length 11.7
  Top Layer w0.762: R5.1 H2.1 47.24,84.88
$1N2223: length 12.7
  Top Layer w0.762: R3.2 31.45,64.87 R4.2 29.46,64.89 arc(27.67,65.64) 26.92,67.43 U1.8
$1N2224: length 12.8
  Top Layer w0.762: R5.2 31.51,84.88 R6.2 29.46,84.9 arc(27.67,84.16) 26.92,82.36 U1.1
$1N2225: length 6.6
  Top Layer w0.762: R7.1 R8.2 18.7,72.11 U1.5
$1N2226: length 6.8
  Top Layer w0.762: R13.1 C8.1 C36.1 24.38,72.11 arc(24.38,72.11) U1.6
$1N2227: length 6.8
  Top Layer w0.762: R14.2 C10.1 C9.1 24.37,77.61 arc(24.37,77.6) U1.3
$1N2238: length 11.8
  Top Layer w0.762: R3.1 35.5,64.82 H4.1 47.24,64.82
$1N2244: length 8.1
  Top Layer w0.762: 18.67,73.95 R9.2 23.05,77.53 U1.4
$1N2423: length 7.3
  Top Layer w0.762: CN27.5 CN27.6 arc(18.28,95.01) 17.07,94.51 D16.2
$1N2424: length 7.4
  Top Layer w0.762: CN27.2 CN27.1 arc(31.83,94.92) 33.13,94.38 D17.1
$1N2910: length 2.5
  Top Layer w0.762: CN28.2 CN28.1
$1N2912: length 7.5
  Top Layer w0.762: 28.76,3.54 CN28.6 31.26,8.48 arc(31.26,8.49) D18.2
$1N2922: length 2.2
  Top Layer w0.762: R23.2 LED4.2
$1N5837: length 8.9
  Top Layer w0.762: 66.84,72.16 66.84,67.25 arc(66.81,67.2) 66.76,67.18 ; 66.76,67.18 R27.2 ; 66.76,67.18 R26.2
$1N6828: length 2
  Top Layer w0.762: R29.2 89.33,91.53 arc(89.33,91.53) LED6.2
$1N6831: length 6.4
  Top Layer w0.762: CN29.2 CN29.1 96.13,64.71 arc(96.12,64.69) D20.1
$1N6833: length 2.1
  Top Layer w0.762: LED5.2 89.19,57.67 arc(89.2,57.66) R28.2
$1N6836: length 6.4
  Top Layer w0.762: CN29.5 CN29.6 96.13,84.85 arc(96.12,84.87) D19.2
$1N6851: length 4.6
  Top Layer w0.762: U13.5 67.79,57.38 arc(67.79,57.38) U16.2
$1N6855: length 17.7
  Top Layer w0.762: U17.1 81.09,57.38 arc(79.29,58.13) 78.55,59.92 78.55,62.64 arc(77.81,64.44) 76.01,65.18 R26.1
$1N6938: length 7.8
  Top Layer w0.762: U16.1 65.25,65.13 arc(65.24,65.17) R27.1
$1N6961: length 4.6
  Top Layer w0.762: U14.5 83.79,57.36 arc(83.78,57.38) U17.2
$1N7310: length 16.9
  Top Layer w0.508: PR2.2 PR2.1 ; U18.2 83.62,68.81 arc(83.23,67.87) R30.2
  Top Layer w0.762: R30.2 79.52,67.48 arc(77.72,68.22) 76.98,70.02 PR2.1
$1N7312: length 7.4
  Top Layer w0.508: U18.3 84.89,68.73 arc(85.25,67.87) R31.2
  Top Layer w0.762: R31.2 88.21,67.51 arc(88.24,67.5) R32.2
$1N7316: length 11.1
  Top Layer w0.762: U19.3 81.91,91.62 arc(83.71,90.88) 84.45,89.08 C13.2 86.54,86.05 arc(86.55,86.05) R10.1
$1N7320: length 18
  Top Layer w0.762: v1(74.75,61.61) 72.87,61.61 arc(71.08,60.87) 70.33,59.07 U16.3 ; v1(82.3,63.96) 82.3,65.46 arc(82.3,65.48) R30.1
  Bottom Layer w0.762: v1(74.75,61.61) 79.95,61.61 arc(81.61,62.3) v1(82.3,63.96)
$1N7321: length 8.2
  Top Layer w0.762: R31.1 86.1,57.59 arc(86.16,57.44) U17.3
$1N7401: length 11.1
  Top Layer w0.762: U19.1 74.84,88.96 arc(74.09,87.17) 72.3,86.42 C51.2 arc(70.15,86.4) 70.12,86.39 R33.2
$1N7406: length 24.8
  Top Layer w0.508: U3.6 66.84,83.35 arc(67.14,84.08) R33.1
  Top Layer w0.762: R33.1 61.44,84.39 arc(59.64,83.64) 58.9,81.85 58.9,77.38 arc(58.9,77.38) PR1.3 PR1.2
$1N7721: length 5.3
  Top Layer w0.762: U15.5 77.28,91.72 arc(77.31,91.65) U19.2
$1N7904: length 14
  Top Layer w0.762: R7.2 C17.2 8.63,74.07 H3.1 arc(8.03,74.7) 7.98,74.72 2.79,74.72
$1N8307: length 12.8
  Top Layer w0.508: R25.2 63.03,68.66 arc(64.82,69.41) 65.56,71.2 65.56,72.16
  Top Layer w0.762: PR1.1 58.9,68.67 arc(58.9,68.66) R25.2
$1N10205: length 21.1
  Top Layer w0.508: U18.6 84.89,83.62 arc(84.76,83.93) C13.1
  Top Layer w0.762: PR2.3 76.98,83.14 arc(77.39,84.15) 78.4,84.56 83.94,84.56 arc(84.31,84.41) C13.1
$1N10928: length 5.7
  Top Layer w0.762: 64.04,19.86 67.04,19.86 arc(67.1,19.89) U23.2 U23.3
$1N10939: length 10.2
  Top Layer w0.762: R37.1 88.9,19.49 arc(88.89,19.51) C56.2 96.9,19.51 arc(96.93,19.52) U27.5
$1N10941: length 4.3
  Top Layer w0.762: 57.78,19.84 62.02,19.84 arc(62.03,19.85) 62.04,19.86
$1N10942: length 7.9
  Top Layer w0.762: R34.1 69.7,22.52 arc(69.69,22.5) U23.4 U23.5
$1N10943: length 8.8
  Top Layer w0.508: U4.3 71.59,19.33 U23.6
  Top Layer w0.762: U23.6 69.66,14.29 arc(69.65,14.27) R36.2
$1N11055: length 25.8
  Top Layer w0.762: U4.6 86.7,19.33 arc(86.83,19.39) C56.1 arc(86.86,19.52) 86.85,19.54 86.85,27.3 arc(86.11,29.09) 84.31,29.84 77.3,29.84
$1N11124: length 16.8
  Top Layer w0.508: 71.62,29.81 71.6,29.8 71.6,21.46 72.46,20.6 U4.2
  Top Layer w0.762: R34.2 74.78,29.81 arc(74.79,29.82) 74.8,29.84
$1N11684: length 2
  Top Layer w0.762: LED7.2 60.2,10.56 arc(60.17,10.57) 60.15,10.61
$1N11686: length 6.4
  Top Layer w0.762: CN30.5 CN30.6 87.44,3.58 arc(87.45,3.58) D21.2
$1N11690: length 2.1
  Top Layer w0.762: R39.2 94.24,10.36 arc(94.28,10.35) LED8.2
$1N11693: length 6.4
  Top Layer w0.762: CN30.2 CN30.1 67.16,3.58 arc(67.15,3.58) D22.1

## Copper pours and planes (outline as drawn; the poured copper is in the pictures)
GND on Top Layer: -13.35,117.36 114.05,117.36 114.05,-23.74 -13.35,-23.74
GND on Bottom Layer: -15.8,114.91 100.85,114.91 100.85,-7.64 -15.8,-7.64

Small or netless copper shapes (teardrops, artwork), in the pictures only: 261 on Top Layer, 4 on Bottom Layer

## Text on the board
Top Silkscreen Layer: B | C | A | 电压测试点 | 单运放放大电路 | 加减法放大电路 | ADC前置电路 | AD835乘法器 | 连接A与C / 断开B同相放大器 / 单独SB2反向放大器
